# EAGLE design L1Demoscene (EAGLE 6.5.0)
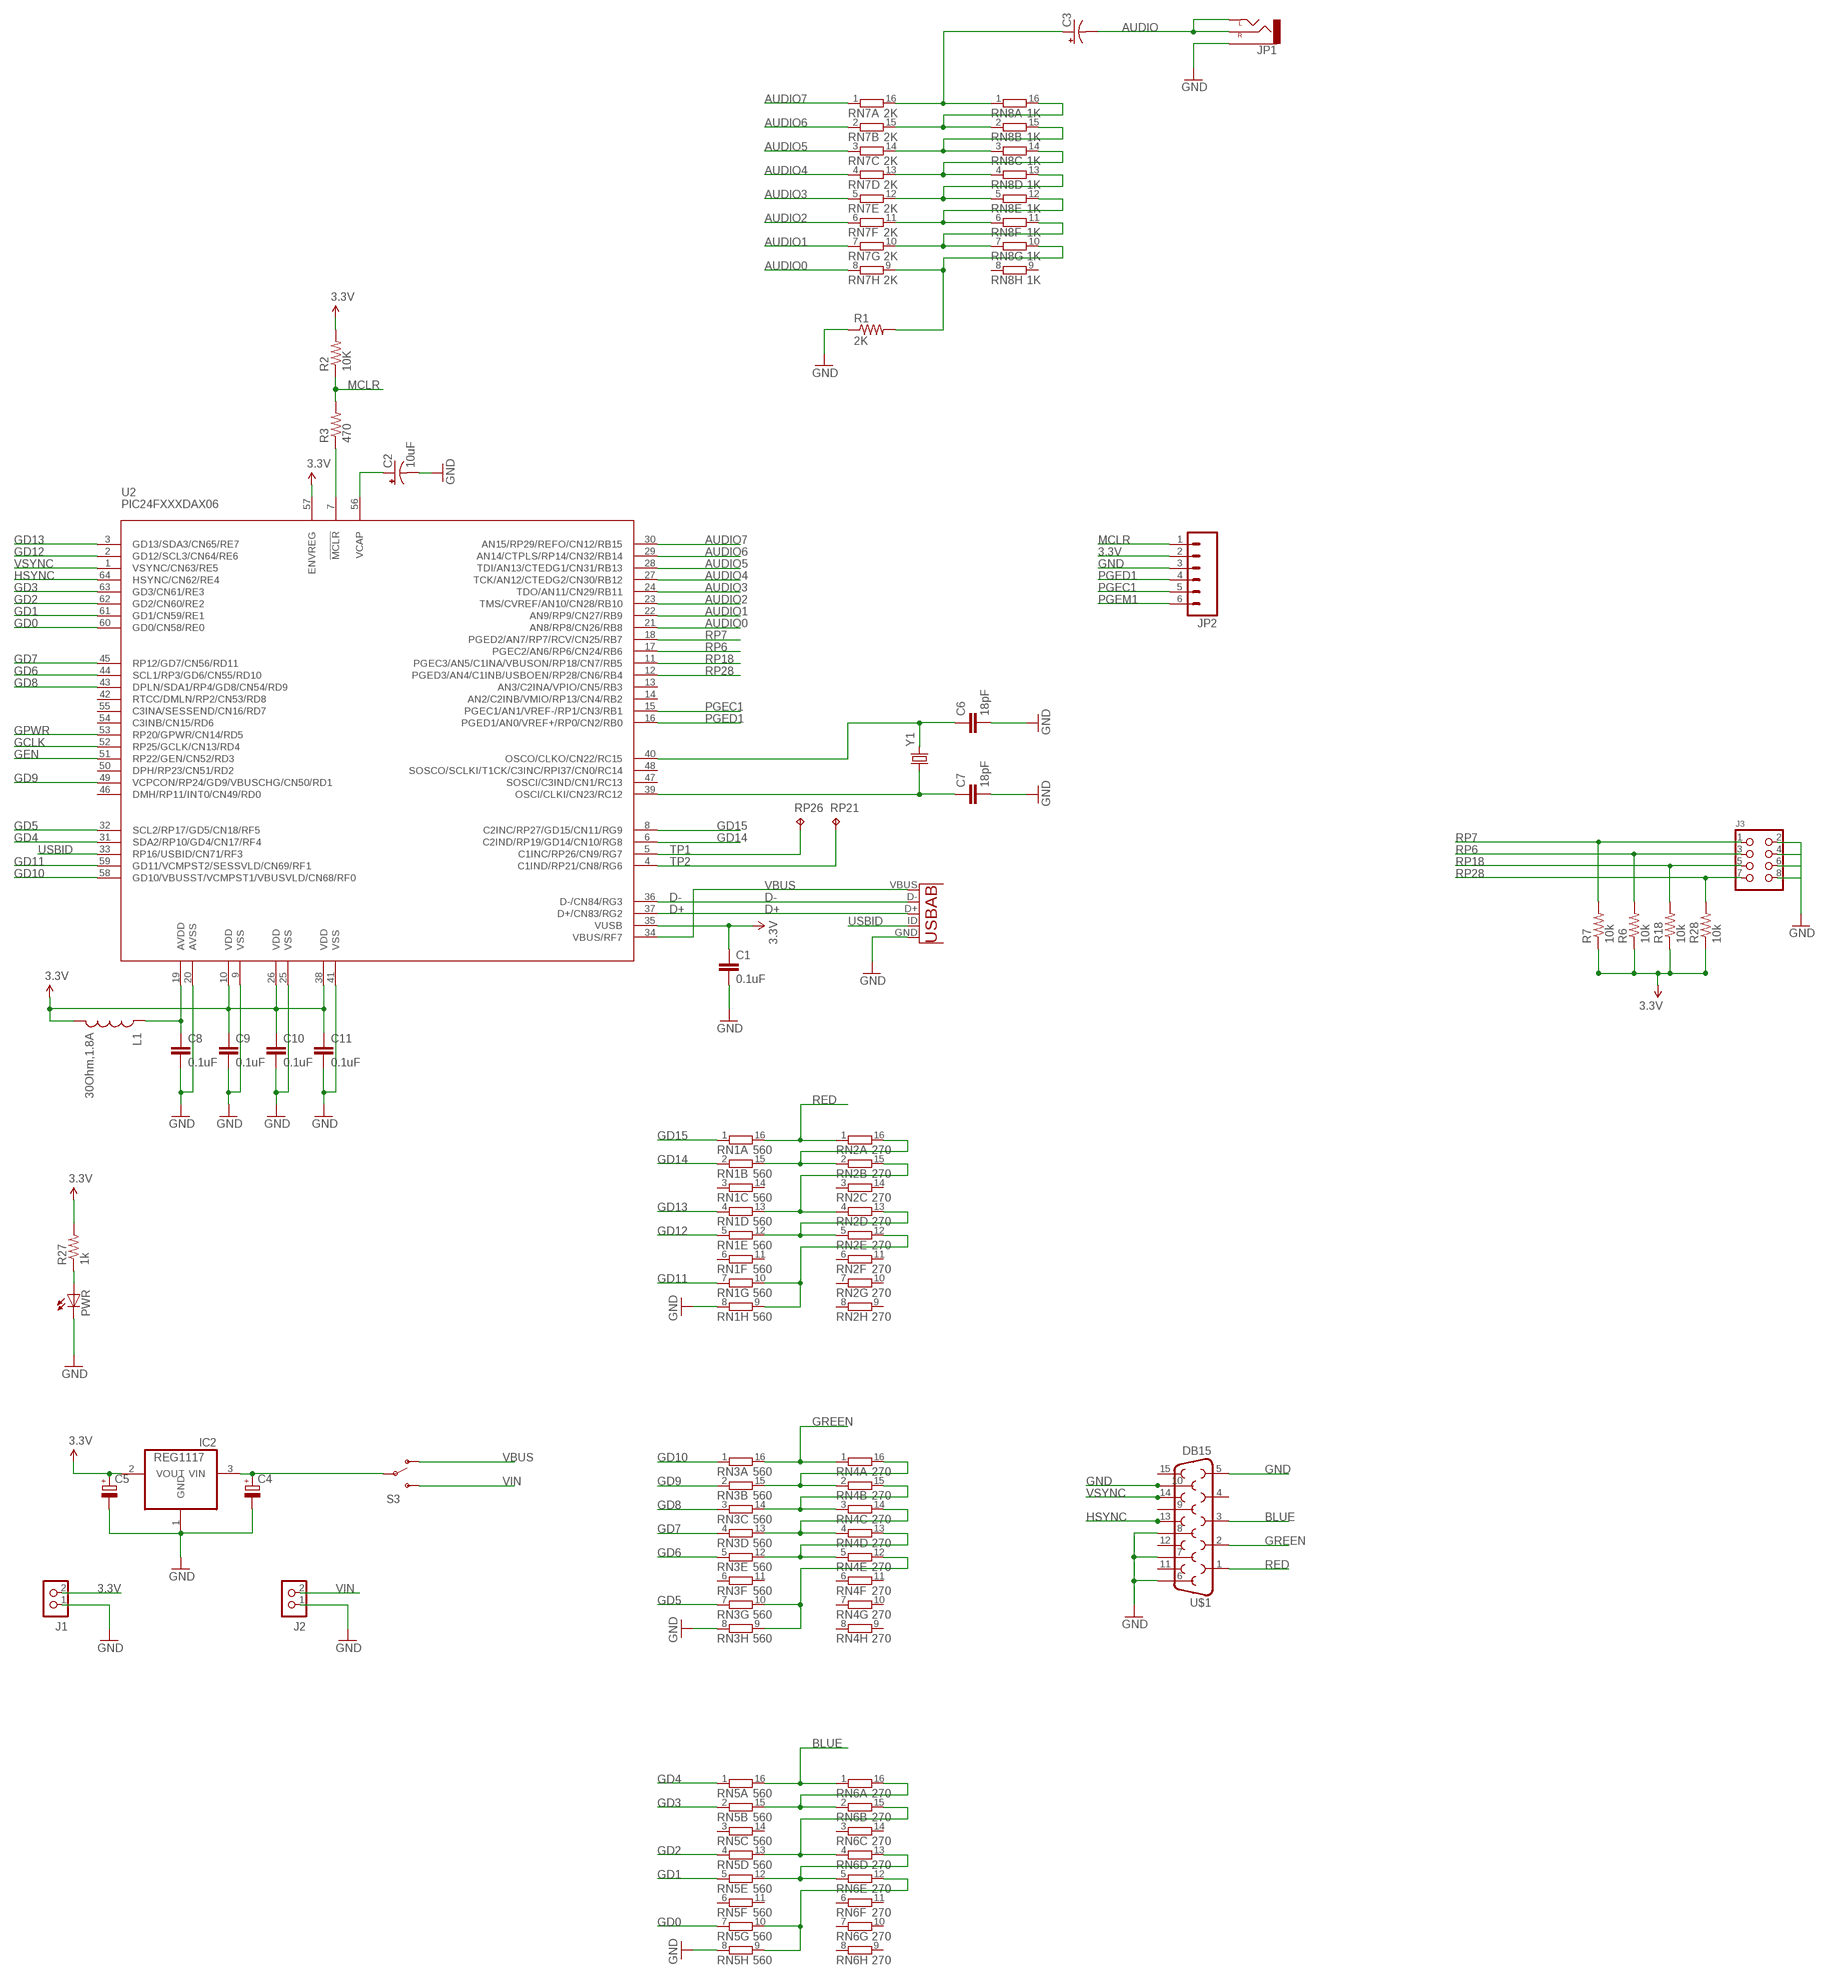
[diagram p0: schematic, sheet 1]

## Parts
C1  0.1uF  CAP0603-CAP  [0603-CAP]
C2  10uF  CAP_POL1206  [EIA3216]
C3  CAP_POL1206  [EIA3216]
C4  CAPACITOR_POL-SMC_A  [SMC_A]
C5  CAPACITOR_POL-SMC_A  [SMC_A]
C6  18pF  CAP0603-CAP  [0603-CAP]
C7  18pF  CAP0603-CAP  [0603-CAP]
C8  0.1uF  CAP0603-CAP  [0603-CAP]
C9  0.1uF  CAP0603-CAP  [0603-CAP]
C10  0.1uF  CAP0603-CAP  [0603-CAP]
C11  0.1uF  CAP0603-CAP  [0603-CAP]
IC2  REG1117  [SOT223]
J1  CON_HEADER_1X02-PTH  [M1X2]
J2  CON_HEADER_1X02-PTH  [M1X2]
J3  CON_HEADER_2X04-PTH  [M2X4]
JP1  AUDIO-JACKPTH  [AUDIO-JACK]
JP2  M06SIP  [1X06]
L1  30Ohm,1.8A  INDUCTOR0402  [C0402]
PWR  LED-0603  [LED-603]
R1  2K  RESISTOR0603-RES  [0603-RES]
R2  10K  RESISTOR0603-RES  [0603-RES]
R3  470  RESISTOR0603-RES  [0603-RES]
R6  10k  RESISTOR0603-RES  [0603-RES]
R7  10k  RESISTOR0603-RES  [0603-RES]
R18  10k  RESISTOR0603-RES  [0603-RES]
R27  1k  RESISTOR0603-RES  [0603-RES]
R28  10k  RESISTOR0603-RES  [0603-RES]
RN1  560  8R-NEXB2HV  [EXB2HV]
RN2  270  8R-NEXB2HV  [EXB2HV]
RN3  560  8R-NEXB2HV  [EXB2HV]
RN4  270  8R-NEXB2HV  [EXB2HV]
RN5  560  8R-NEXB2HV  [EXB2HV]
RN6  270  8R-NEXB2HV  [EXB2HV]
RN7  2K  8R-NEXB2HV  [EXB2HV]
RN8  1K  8R-NEXB2HV  [EXB2HV]
RP21  TPTP06R  [TP06R]
RP26  TPTP06R  [TP06R]
S3  SWITCH-SPDT-SMD-A  [SWITCH-SPST-SMD-A]
U2  PIC24FXXXDAX06  [PIC24FXXX_TQFP64]
U3  USB-AB  [USB-AB-MICRO-SMD]
U$1  DB15  [DB15]
Y1  CRYSTAL5X3  [CRYSTAL-SMD-5X3]

## Nets
3.3V: C1.1 C5.+ C9.1 C10.1 C11.1 IC2.2(VOUT) J1.2 JP2.2 L1.2 R2.2 R6.1 R7.1 R18.1 R27.2 R28.1 U2.10(VDD) U2.26(VDD) U2.35(VUSB) U2.38(VDD) U2.57(ENVREG)
AUDIO: C3.C(-) JP1.RING(RIGHT) JP1.TIP(LEFT)
AUDIO0: RN7.8 U2.21(AN8/RP8/CN26/RB8)
AUDIO1: RN7.7 U2.22(AN9/RP9/CN27/RB9)
AUDIO2: RN7.6 U2.23(TMS/CVREF/AN10/CN28/RB10)
AUDIO3: RN7.5 U2.24(TDO/AN11/CN29/RB11)
AUDIO4: RN7.4 U2.27(TCK/AN12/CTEDG2/CN30/RB12)
AUDIO5: RN7.3 U2.28(TDI/AN13/CTEDG1/CN31/RB13)
AUDIO6: RN7.2 U2.29(AN14/CTPLS/RP14/CN32/RB14)
AUDIO7: RN7.1 U2.30(AN15/RP29/REFO/CN12/RB15)
BLUE: RN5.16 RN6.1 U$1.3
D+: U2.37(D+/CN83/RG2) U3.D+
D-: U2.36(D-/CN84/RG3) U3.D-
GCLK: U2.52(RP25/GCLK/CN13/RD4)
GD0: RN5.7 U2.60(GD0/CN58/RE0)
GD1: RN5.5 U2.61(GD1/CN59/RE1)
GD2: RN5.4 U2.62(GD2/CN60/RE2)
GD3: RN5.2 U2.63(GD3/CN61/RE3)
GD4: RN5.1 U2.31(SDA2/RP10/GD4/CN17/RF4)
GD5: RN3.7 U2.32(SCL2/RP17/GD5/CN18/RF5)
GD6: RN3.5 U2.44(SCL1/RP3/GD6/CN55/RD10)
GD7: RN3.4 U2.45(RP12/GD7/CN56/RD11)
GD8: RN3.3 U2.43(DPLN/SDA1/RP4/GD8/CN54/RD9)
GD9: RN3.2 U2.49(VCPCON/RP24/GD9/VBUSCHG/CN50/RD1)
GD10: RN3.1 U2.58(GD10/VBUSST/VCMPST1/VBUSVLD/CN68/RF0)
GD11: RN1.7 U2.59(GD11/VCMPST2/SESSVLD/CN69/RF1)
GD12: RN1.5 U2.2(GD12/SCL3/CN64/RE6)
GD13: RN1.4 U2.3(GD13/SDA3/CN65/RE7)
GD14: RN1.2 U2.6(C2IND/RP19/GD14/CN10/RG8)
GD15: RN1.1 U2.8(C2INC/RP27/GD15/CN11/RG9)
GEN: U2.51(RP22/GEN/CN52/RD3)
GND: C1.2 C2.C(-) C4.- C5.- C6.2 C7.2 C8.2 C9.2 C10.2 C11.2 IC2.1(GND) J1.1 J2.1 J3.2 J3.4 J3.6 J3.8 JP1.SLEEVE JP2.3 PWR.C R1.1 RN1.8 RN3.8 RN5.8 U2.9(VSS) U2.20(AVSS) U2.25(VSS) U2.41(VSS) U3.GND U$1.5 U$1.6 U$1.7 U$1.8 U$1.10
GPWR: U2.53(RP20/GPWR/CN14/RD5)
GREEN: RN3.16 RN4.1 U$1.2
HSYNC: U2.64(HSYNC/CN62/RE4) U$1.13
MCLR: JP2.1 R2.1 R3.2
N$1: C8.1 L1.1 U2.19(AVDD)
N$2: C3.A(+) RN7.16 RN8.1
N$3: C7.1 U2.39(OSCI/CLKI/CN23/RC12) Y1.1
N$4: R3.1 U2.7(!MCLR)
N$5: RN7.15 RN8.2 RN8.16
N$6: RN7.14 RN8.3 RN8.15
N$7: C4.+ IC2.3(VIN) S3.2(P)
N$8: C2.A(+) U2.56(VCAP)
N$9: RN7.13 RN8.4 RN8.14
N$10: PWR.A R27.1
N$11: RN7.12 RN8.5 RN8.13
N$12: RN7.11 RN8.6 RN8.12
N$13: RN7.10 RN8.7 RN8.11
N$14: RN3.15 RN4.2 RN4.16
N$15: RN3.14 RN4.3 RN4.15
N$16: RN3.13 RN4.4 RN4.14
N$17: RN3.12 RN4.5 RN4.13
N$18: RN3.9 RN3.10 RN4.12
N$19: R1.2 RN7.9 RN8.10
N$20: C6.1 U2.40(OSCO/CLKO/CN22/RC15) Y1.3
N$24: RN1.13 RN2.4 RN2.15
N$26: RN1.15 RN2.2 RN2.16
N$27: RN1.12 RN2.5 RN2.13
N$28: RN1.9 RN1.10 RN2.12
N$31: RN5.15 RN6.2 RN6.16
N$32: RN5.13 RN6.4 RN6.15
N$33: RN5.12 RN6.5 RN6.13
N$34: RN5.9 RN5.10 RN6.12
PGEC1: JP2.5 U2.15(PGEC1/AN1/VREF-/RP1/CN3/RB1)
PGED1: JP2.4 U2.16(PGED1/AN0/VREF+/RP0/CN2/RB0)
PGEM1: JP2.6
RED: RN1.16 RN2.1 U$1.1
RP6: J3.3 R6.2 U2.17(PGEC2/AN6/RP6/CN24/RB6)
RP7: J3.1 R7.2 U2.18(PGED2/AN7/RP7/RCV/CN25/RB7)
RP18: J3.5 R18.2 U2.11(PGEC3/AN5/C1INA/VBUSON/RP18/CN7/RB5)
RP28: J3.7 R28.2 U2.12(PGED3/AN4/C1INB/USBOEN/RP28/CN6/RB4)
TP1: RP26.TP U2.5(C1INC/RP26/CN9/RG7)
TP2: RP21.TP U2.4(C1IND/RP21/CN8/RG6)
USBID: U2.33(RP16/USBID/CN71/RF3) U3.ID(USBID)
VBUS: S3.1(O) U2.34(VBUS/RF7) U3.VBUS
VIN: J2.2 S3.3(S)
VSYNC: U2.1(VSYNC/CN63/RE5) U$1.14
Unconnected: RN1.3 RN1.6 RN1.11 RN1.14 RN2.3 RN2.6 RN2.7 RN2.8 RN2.9 RN2.10 RN2.11 RN2.14 RN3.6 RN3.11 RN4.6 RN4.7 RN4.8 RN4.9 RN4.10 RN4.11 RN5.3 RN5.6 RN5.11 RN5.14 RN6.3 RN6.6 RN6.7 RN6.8 RN6.9 RN6.10 RN6.11 RN6.14 RN8.8 RN8.9 U2.13(AN3/C2INA/VPIO/CN5/RB3) U2.14(AN2/C2INB/VMIO/RP13/CN4/RB2) U2.42(RTCC/DMLN/RP2/CN53/RD8) U2.46(DMH/RP11/INT0/CN49/RD0) U2.47(SOSCI/C3IND/CN1/RC13) U2.48(SOSCO/SCLKI/T1CK/C3INC/RPI37/CN0/RC14) U2.50(DPH/RP23/CN51/RD2) U2.54(C3INB/CN15/RD6) U2.55(C3INA/SESSEND/CN16/RD7) U$1.4 U$1.9 U$1.11 U$1.12 U$1.15

## Library data of the parts
C1 C6-C11 = SparkFun-Capacitors:CAP: Capacitor Standard 0603 ceramic capacitor, and 0.1" leaded capacitor.
C2 C3 = SparkFun-Capacitors:CAP_POL: Capacitor Polarized These are standard SMD and PTH capacitors. Normally 10uF, 47uF, and 100uF in electrolytic and tantalum varieties. Always verify the external diameter of the through hole cap, it varies with capacity, voltage, and manufacturer. The EIA devices should be standard.
C4 C5 = dp_devices:CAPACITOR_POL: Polarized capacitor in various packages
IC2 = burr-brown:REG1117: 800mA and 1A Low Dropout (LDO) Positive Regulator 1.8V, 2.5V, 2.85V, 3.3V, 5V, and Adj; MPN: REG1117; OC_FARNELL: 1097566; OC_NEWARK: 14P6981
J1 J2 = dp_devices:CON_HEADER_1X02
J3 = dp_devices:CON_HEADER_2X04
JP1 = SparkFun-Connectors:AUDIO-JACK: 3.5mm Audio Jack Simple 3.5mm common PCB mount audio jack. SKU: PRT-08032
JP2 = SparkFun-Connectors:M06: Header 6 Standard 6-pin 0.1" header. Use with straight break away headers (SKU : PRT-00116), right angle break away headers (PRT-00553), swiss pins (PRT-00743), machine pins (PRT-00117), and female headers (PRT-00115). Molex polarized connector foot print use with SKU : PRT-08094 with associated crimp pins and housings. NOTES ON THE VARIANTS LOCK and LOCK_LONGPADS... This footprint was designed to help hold the alignment of a through-hole component (i.e. 6-pin header) while soldering it into place. You may notice that each hole has been shifted either up or down by 0.005 of an inch from it's more standard position (which is a perfectly straight line). This slight alteration caused the pins (the squares in the middle) to touch the edges of the holes. Because they are alternating, it causes a "brace" to hold the component in place. 0.005 has proven to be the perfect amount of "off-center" position when using our standard breakaway headers. Although looks a little odd when you look at the bare footprint, once you have a header in there, the alteration is very hard to notice. Also,if you push a header all the way into place, it is covered up entirely on the bottom side. This idea of altering the position of holes to aid alignment will be further integrated into the Sparkfun Library for other footprints. It can help hold any component with 3 or more connection pins.
L1 = SparkFun-Passives:INDUCTOR: Inductors Basic Inductor/Choke - 0603 and 1206. Footprints are not proven and vary greatly between part numbers. SRN6045- 33uH, 20% 1.4A SDR0403-560KL - 56uH, 10%, 500mA RMS/740mA peak
PWR = dp_devices:LED: Light Emitting Diode
R1-R3 R6 R7 R18 R27 R28 = SparkFun-Resistors:RESISTOR: Resistor Basic schematic elements and footprints for 0603, 1206, and PTH resistors.
RN1-RN8 = resistor-dil:8R-N: DIL RESISTOR; OC_FARNELL: unknown; OC_NEWARK: unknown
RP21 RP26 = testpad:TP: Test pad
S3 = SparkFun-Electromechanical:SWITCH-SPDT: SPDT Switch Simple slide switch, Spark Fun Electronics SKU : COM-00102 DPDT SMT slide switch, AYZ0202, SWCH-08179
U2 = SparkFun-DigitalIC:PIC24FXXXDAX06: PIC24FXXXDAX06 PIC24FXXXDA106 / PIC24FXXXDA206 PIC24FJ256DA206-I/PT for IOIO IC-10386; PROD_ID: IC-10386
U3 = SparkFun-Connectors:USB-AB: This is a USB AB connector that is compatible with USB OTG. i.e. this connector can serve as a host or device
U$1 = SparkFun-Connectors:DB15: DB15 / VGA right angle through-hole female connector.
Y1 = SparkFun-FreqCtrl:CRYSTAL: Various standard crystals. Proven footprints. Spark Fun Electronics SKU : COM-00534

## Board
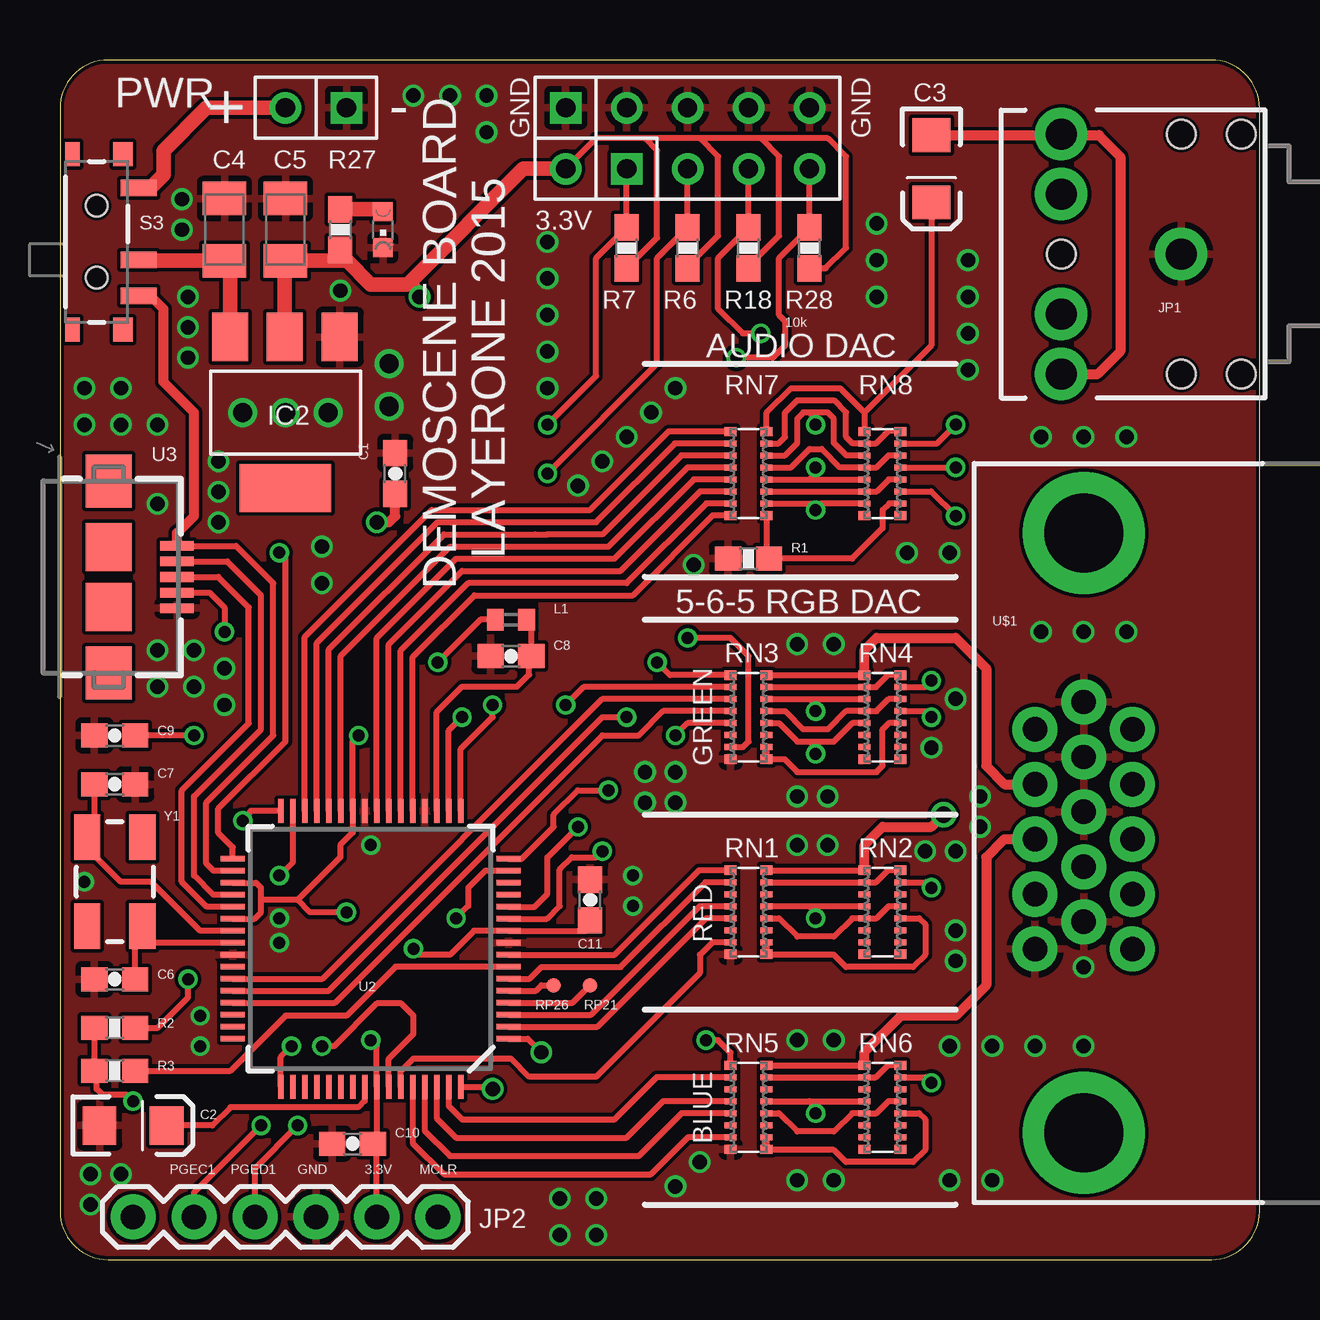
[diagram p1: board, top side]
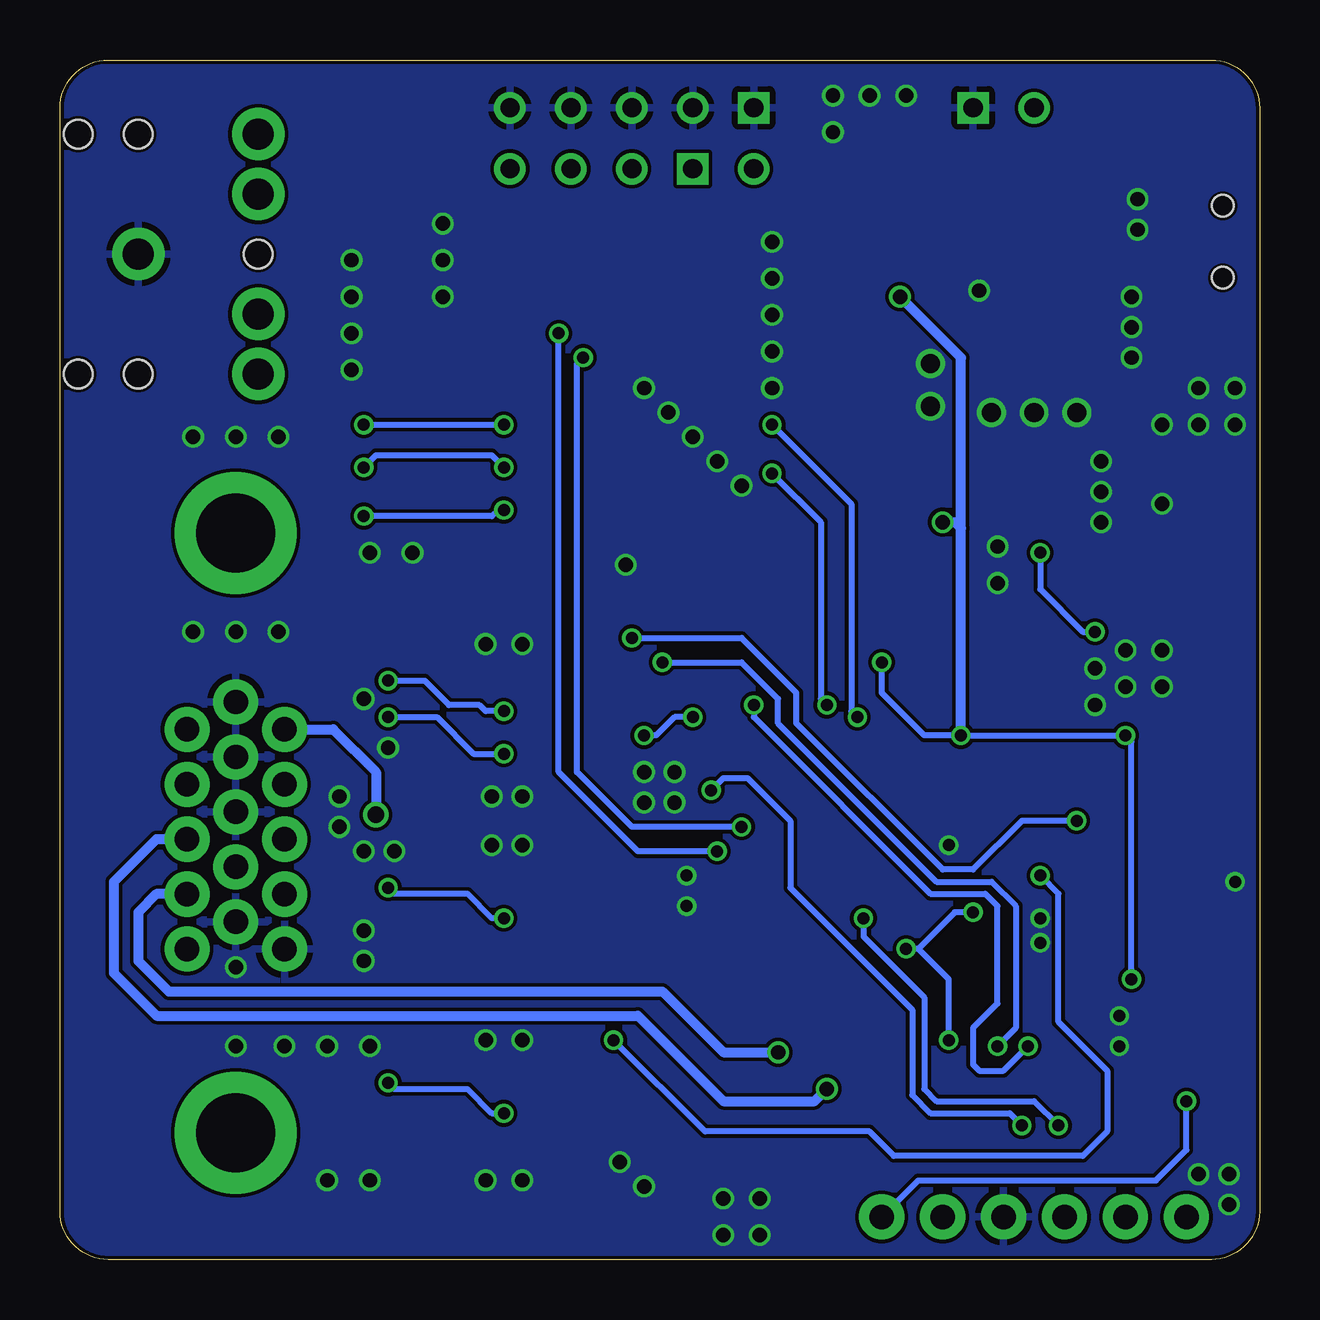
[diagram p2: board, bottom side, seen from below]

Size 50 x 50 mm. Coordinates in mm from the lower left corner, seen from the top.
Outline: 50,2 50,48 arc90 48,50 2,50 arc90 0,48 0,2 arc90 2,0 48,0 arc90 50,2
Copper layers (1*16): Top 0.035mm / dielectric 1.5mm / Bottom 0.035mm
Design rules "hackvana": minimum track width 6mil, minimum drill 0.3mm, track to track 6mil, track to pad 6mil, pad to pad 6mil, via to via 6mil, smd to smd 0mil, copper to edge 6mil, drill to drill 6mil, minimum pad ring 10mil, minimum via ring 6mil, stop-mask expansion 2mil, vias tented up to drill 100mil, thermal gap 10mil

### Footprints (pad centres in the part's own frame; a part is rotated, then mirrored left to right if it is on the bottom)
0603-CAP = smd 1.1 x 1: 1 -0.85,0; 2 0.85,0
EIA3216 = smd 1.4 x 1.6: A 1.4,0; C -1.4,0
SMC_A = smd 1.4 x 1.8: + -1.3,0; - 1.3,0
SOT223 = smd 1.499 x 2.007: 1 -2.261,-3.15; 2 0.025,-3.15; 3 2.311,-3.15 | smd 3.81 x 2.007: 4 0,3.15
M1X2 = drill 0.8 square: 1 -1.27,0 | drill 0.8: 2 1.27,0
M2X4 = drill 0.8 square: 1 -3.81,-1.27 | drill 0.8: 2 -3.81,1.27; 3 -1.27,-1.27; 4 -1.27,1.27; 5 1.27,-1.27; 6 1.27,1.27; 7 3.81,-1.27; 8 3.81,1.27
AUDIO-JACK = drill 1.3 pad 2.184: RING 5,5; RSH 5,2.5; SLEEVE 0,0; TIP 5,-5; TSH 5,-2.5 | hole 1.2: 0,5; -2.5,5; -2.5,-5; 0,-5; 5,0
1X06 = drill 1.016 pad 1.88: 1 0,0; 2 2.54,0; 3 5.08,0; 4 7.62,0; 5 10.16,0; 6 12.7,0
C0402 = smd 0.7 x 0.9: 1 -0.65,0; 2 0.65,0
LED-603 = smd 0.8 x 0.8: A 0,-0.75; C 0,0.75
0603-RES = smd 1.1 x 1: 1 -0.85,0; 2 0.85,0
EXB2HV = smd 0.38 x 0.5: 1 -1.75,-0.75; 8 1.75,-0.75; 9 1.75,0.75; 16 -1.75,0.75 | smd 0.25 x 0.5: 2 -1.25,-0.75; 3 -0.75,-0.75; 4 -0.25,-0.75; 5 0.25,-0.75; 6 0.75,-0.75; 7 1.25,-0.75; 10 1.25,0.75; 11 0.75,0.75; 12 0.25,0.75; 13 -0.25,0.75; 14 -0.75,0.75; 15 -1.25,0.75
TP06R = smd 0.6 x 0.6: TP 0,0
SWITCH-SPST-SMD-A = smd 0.7 x 1.5: 1 -2.25,-1.75; 2 -0.75,-1.75; 3 2.25,-1.75 | smd 1 x 0.6: GND1 -3.65,1; GND3 3.65,1 | smd 1 x 0.8: GND2 -3.65,-1.1; GND4 3.65,-1.1 | hole 0.9: -1.5,0; 1.5,0
PIC24FXXX_TQFP64 = smd 0.22 x 1: 1 -3.75,-5.75; 2 -3.25,-5.75; 3 -2.75,-5.75; 4 -2.25,-5.75; 5 -1.75,-5.75; 6 -1.25,-5.75; 7 -0.75,-5.75; 8 -0.25,-5.75; 9 0.25,-5.75; 10 0.75,-5.75; 11 1.25,-5.75; 12 1.75,-5.75; 13 2.25,-5.75; 14 2.75,-5.75; 15 3.25,-5.75; 16 3.75,-5.75; 33 3.75,5.75; 34 3.25,5.75; 35 2.75,5.75; 36 2.25,5.75; 37 1.75,5.75; 38 1.25,5.75; 39 0.75,5.75; 40 0.25,5.75; 41 -0.25,5.75; 42 -0.75,5.75; 43 -1.25,5.75; 44 -1.75,5.75; 45 -2.25,5.75; 46 -2.75,5.75; 47 -3.25,5.75; 48 -3.75,5.75 | smd 1 x 0.22: 17 5.75,-3.75; 18 5.75,-3.25; 19 5.75,-2.75; 20 5.75,-2.25; 21 5.75,-1.75; 22 5.75,-1.25; 23 5.75,-0.75; 24 5.75,-0.25; 25 5.75,0.25; 26 5.75,0.75; 27 5.75,1.25; 28 5.75,1.75; 29 5.75,2.25; 30 5.75,2.75; 31 5.75,3.25; 32 5.75,3.75; 49 -5.75,3.75; 50 -5.75,3.25; 51 -5.75,2.75; 52 -5.75,2.25; 53 -5.75,1.75; 54 -5.75,1.25; 55 -5.75,0.75; 56 -5.75,0.25; 57 -5.75,-0.25; 58 -5.75,-0.75; 59 -5.75,-1.25; 60 -5.75,-1.75; 61 -5.75,-2.25; 62 -5.75,-2.75; 63 -5.75,-3.25; 64 -5.75,-3.75
USB-AB-MICRO-SMD = smd 1.4 x 0.4: D+ 2.85,0; D- 2.85,0.65; GND 2.85,-1.3; ID 2.85,-0.65; VBUS 2.85,1.3 | smd 1.9 x 2: P$6 0,1.25; P$7 0,-1.25 | smd 1.9 x 2.2: P$8 0,4; P$9 0,-4
DB15 = drill 1.016 pad 1.88: 1 -4.32,-7.112; 2 -2.03,-7.112; 3 0.26,-7.112; 4 2.55,-7.112; 5 4.84,-7.112; 6 -5.46,-5.08; 7 -3.17,-5.08; 8 -0.88,-5.08; 9 1.41,-5.08; 10 3.7,-5.08; 11 -4.32,-3.048; 12 -2.03,-3.048; 13 0.26,-3.048; 14 2.55,-3.048; 15 4.84,-3.048 | drill 3.302 pad 5.08: G1 -12.5,-5.08; G2 12.5,-5.08
CRYSTAL-SMD-5X3 = smd 1.9 x 1.1: 1 -1.85,-1.15; 2 1.85,-1.15; 3 1.85,1.15; 4 -1.85,1.15

### Placement (x,y rotation side)
C1  13.97,32.77 90 top
C2  3.05,5.59 0 top
C3  36.32,45.47 270 top
C4  6.86,42.93 90 top
C5  9.4,42.93 90 top
C6  2.29,11.68 180 top
C7  2.29,19.81 0 top
C8  18.8,25.15 180 top
C9  2.29,21.84 180 top
C10  12.19,4.83 180 top
C11  22.1,14.99 90 top
IC2  9.4,35.31 180 top
J1  21.08,46.74 270 top
J2  10.67,48.01 180 top
J3  27.43,46.74 0 top
JP1  46.74,41.91 180 top
JP2  15.75,1.78 180 top
L1  18.8,26.67 180 top
PWR  13.46,42.93 180 top
R1  28.7,29.21 0 top
R2  2.29,9.65 0 top
R3  2.29,7.87 180 top
R6  26.16,42.16 90 top
R7  23.62,42.16 90 top
R18  28.7,42.16 90 top
R27  11.68,42.93 270 top
R28  31.24,42.16 90 top
RN1  28.7,14.48 270 top
RN2  34.29,14.48 270 top
RN3  28.7,22.61 270 top
RN4  34.29,22.61 270 top
RN5  28.7,6.35 270 top
RN6  34.29,6.35 270 top
RN7  28.7,32.77 270 top
RN8  34.29,32.77 270 top
RP21  22.1,11.43 0 top
RP26  20.57,11.43 0 top
S3  1.52,42.42 90 top
U2  12.95,12.95 90 top
U3  2.03,28.45 0 top
U$1  47.75,17.78 270 top
Y1  2.29,15.75 270 top

### Tracks (layer width: path | path; a pad name or v marks a point on that pad's centre or on a via)
3.3V  (via drill 0.5, 0.6)
  Top 0.254: C11.1 21.92,13.7 U2.10 17.26,13.7 16.26,12.7 14.99,12.7 v14.73,12.95 | JP2.2 13.21,4.66 C10.1 13.2,4.99 U2.57 13.2,8.89 v12.95,9.14 | U2.35 8.17,15.7 8.38,15.49 8.38,14.99 | U2.38 8.11,14.2 8.38,14.48 8.38,14.99 | R7.1 24.89,42.58 24.89,46.23 24.38,46.74 | R6.1 26.16,41.4 27.43,42.67 27.43,45.97 26.67,46.74 | 24.38,46.74 22.35,46.74 J1.2 | 26.67,46.74 24.38,46.74 | R18.1 28.7,41.4 29.97,42.67 29.97,45.97 29.21,46.74 | 29.21,46.74 26.67,46.74 | R28.1 31.92,41.31 32.77,42.16 32.77,45.97 32,46.74 29.21,46.74 | 9.91,14.99 8.38,14.99 | v11.94,14.48 10.41,14.48 9.91,14.99 | v12.45,21.84 12.2,21.6 U2.26 12.2,17.79 11.68,17.27 11.68,16.76 9.91,14.99 | L1.2 17.53,26.67 v15.75,24.89 | v5.33,11.68 5.33,10.92 4.06,9.65 R2.2 | v5.59,21.84 C9.1
  Top 0.406: v14.99,40.13 14.99,40.39 14.61,40.77 | v13.21,30.73 13.72,30.73 13.97,30.99 C1.1
  Top 0.61: IC2.2 9.37,41.6 C5.+ 11.97,41.63 | 11.97,41.63 12.95,40.64 14.48,40.64 14.61,40.77 19.3,45.47 J1.2 | R27.2 11.68,41.91 11.97,41.63
  Bottom 0.254: v12.95,9.14 12.95,11.68 14.22,12.95 | 14.22,12.95 v14.73,12.95 | v11.94,14.48 12.7,14.48 14.22,12.95 | v5.33,11.68 5.33,21.59 v5.59,21.84 v12.45,21.84 13.97,21.84 15.75,23.62 v15.75,24.89
  Bottom 0.406: v12.45,21.84 12.45,30.48 | 12.45,30.48 12.45,37.59 v14.99,40.13 | v13.21,30.73 12.7,30.73 12.45,30.48
AUDIO
  Top 0.406: C3.C 41.69,46.87 | 41.69,46.87 JP1.TIP | 41.69,46.87 43.3,46.87 44.2,45.97 44.2,37.85 43.26,36.91 JP1.RING
AUDIO0
  Top 0.254: U2.21 14.7,25.12 17.27,27.69 23.88,27.69 27.21,31.02 RN7.8
AUDIO1
  Top 0.254: U2.22 14.2,25.38 17.02,28.19 23.62,28.19 26.94,31.52 RN7.7
AUDIO2
  Top 0.254: U2.23 13.7,25.64 16.76,28.7 23.37,28.7 26.68,32.02 RN7.6
AUDIO3
  Top 0.254: U2.24 13.2,25.9 16.51,29.21 23.11,29.21 26.42,32.52 RN7.5
AUDIO4
  Top 0.254: U2.27 11.7,25.17 16.26,29.72 22.86,29.72 26.16,33.02 RN7.4
AUDIO5
  Top 0.254: U2.28 11.2,25.43 16,30.23 19.81,30.23 20.32,30.23 22.61,30.23 25.9,33.52 RN7.3
AUDIO6
  Top 0.254: U2.29 10.7,25.69 15.75,30.73 22.35,30.73 25.63,34.02 RN7.2
AUDIO7
  Top 0.254: U2.30 10.2,25.95 15.49,31.24 22.1,31.24 25.37,34.52 RN7.1
BLUE
  Top 0.254: RN5.16 RN6.1
  Top 0.406: RN6.1 33.54,8.65 35.05,10.16 37.34,10.16 38.61,11.43 38.61,16.76 39.37,17.53 U$1.3
D+
  Top 0.254: U2.37 6.12,14.7 5.08,15.75 5.08,19.56 7.87,22.35 7.87,27.18 6.6,28.45 U3.D+
D-
  Top 0.254: U2.36 6.39,15.2 5.59,16 5.59,19.3 8.38,22.1 8.38,27.69 6.97,29.1 U3.D-
GD0
  Top 0.254: U2.60 14.7,4.85 16,3.56 24.64,3.56 26.18,5.1 RN5.7
GD1
  Top 0.254: U2.61 15.2,5.37 16.26,4.32 24.13,4.32 25.91,6.1 RN5.5
GD2
  Top 0.254: U2.62 15.7,5.89 16.51,5.08 23.62,5.08 25.14,6.6 RN5.4
GD3
  Top 0.254: U2.63 16.2,6.4 16.76,5.84 23.11,5.84 24.87,7.6 RN5.2
GD4  (via drill 0.5)
  Top 0.254: U2.31 9.7,16.56 v9.14,16 | RN5.1 27.95,8.62 27.43,9.14 v26.92,9.14
  Bottom 0.254: v26.92,9.14 23.11,5.33 16.26,5.33 15.24,4.32 7.37,4.32 6.35,5.33 6.35,7.87 8.38,9.91 8.38,15.24 v9.14,16
GD5  (via drill 0.5)
  Top 0.254: RN3.7 28.47,21.36 28.7,21.59 28.7,25.15 27.94,25.91 v26.16,25.91 | U2.32 7.97,18.7 v7.62,18.29
  Bottom 0.254: v26.16,25.91 21.59,25.91 19.3,23.62 19.3,22.35 13.21,16.26 11.94,16.26 9.91,18.29 v7.62,18.29
GD6  (via drill 0.5)
  Top 0.254: U2.44 11.2,11.2 22.61,22.61 v23.62,22.61 | RN3.5 26.17,22.36 v25.65,21.84
  Bottom 0.254: v23.62,22.61 24.38,22.61 25.15,21.84 v25.65,21.84
GD7
  Top 0.254: U2.45 11.47,10.7 22.61,21.84 24.13,21.84 25.14,22.86 RN3.4
GD8
  Top 0.254: U2.43 10.94,11.7 22.59,23.36 RN3.3
GD9  (via drill 0.5)
  Top 0.254: RN3.2 21.82,23.86 v21.08,23.11 | U2.49 9.2,8.44 v9.65,8.89
  Bottom 0.254: v21.08,23.11 21.08,22.61 13.72,15.24 11.43,15.24 10.92,14.73 10.92,10.67 11.94,9.65 11.94,8.13 11.68,7.87 10.67,7.87 v9.65,8.89
GD10  (via drill 0.5)
  Top 0.254: RN3.1 25.43,24.36 v24.89,24.89 | U2.58 13.7,8.37 14.73,9.4 14.73,10.16 14.22,10.67 13.21,10.67 11.43,8.89 v10.92,8.89
  Bottom 0.254: v24.89,24.89 21.59,24.89 20.07,23.37 20.07,22.35 13.46,15.75 11.18,15.75 10.16,14.73 10.16,9.65 v10.92,8.89
GD11
  Top 0.254: U2.59 14.2,7.85 14.73,8.38 18.8,8.38 19.56,7.62 22.35,7.62 26.67,11.94 26.67,12.7 27.2,13.23 RN1.7
GD12
  Top 0.254: RN1.5 26.93,14.23 22.4,9.7 U2.2
GD13
  Top 0.254: RN1.4 26.67,14.73 22.14,10.2 U2.3
GD14
  Top 0.254: RN1.2 26.9,15.73 23.37,12.19 20.07,12.19 19.58,11.7 U2.6
GD15
  Top 0.254: U2.8 23.12,12.7 26.64,16.23 RN1.1
GND  (via drill 0.5, 0.6, 0.8)
  other vias: 23.88,16 23.88,14.73 9.14,14.22 9.14,13.21 5.84,10.16 5.84,8.89 1.02,15.75 12.95,17.27 4.06,31.5 4.06,25.4 25.65,3.05 26.67,4.06 30.73,17.27 32,17.27 26.42,28.96 25.65,20.32 24.38,20.32 6.86,24.64 6.86,23.11 7.62,35.31 9.4,35.31 11.18,35.31 13.72,37.34 13.72,35.56 1.02,34.8 2.54,34.8 4.06,34.8 2.54,36.32 1.02,36.32 5.59,25.4 5.59,23.88 4.06,23.88 10.92,28.19 10.92,29.72 6.6,30.73 6.6,32 6.6,33.27 5.33,37.59 5.33,38.86 5.33,40.13 11.68,40.39 21.59,32.26 22.61,33.27 23.62,34.29 24.64,35.31 25.65,36.32 5.08,44.2 5.08,42.93 30.73,3.3 32.26,3.3 37.08,3.3 38.86,3.3 38.86,8.89 37.08,8.89 42.67,12.19 32.26,9.14 30.73,9.14 24.38,19.05 25.65,19.05 30.73,19.3 32,19.3 42.67,8.89 34.04,40.13 34.04,41.66 20.32,37.85 30.73,25.65 32.26,25.65 42.67,26.16 44.45,26.16 34.04,43.18 35.31,29.46 37.08,29.46 40.89,34.29 42.67,34.29 44.45,34.29 40.89,26.16 37.85,37.08 37.85,38.61 37.85,40.13 37.85,41.66 36.07,17.02 37.34,17.02 38.35,18.03 38.35,19.3 37.34,13.72 37.34,12.45 40.64,8.89 37.34,23.37 36.32,21.34 20.32,36.32 20.32,39.37 20.32,40.89 20.32,42.42 17.78,48.51 17.78,46.99 16.26,48.51 14.73,48.51 1.27,2.29 1.27,3.56 2.54,3.56 20.83,2.54 22.35,2.54 20.83,1.02 22.35,1.02
  pour Bottom: 0,0 50,0 50,50 0,50
  pour Top: 0,0 50,0 50,50 0,50
GREEN
  Top 0.254: RN3.16 RN4.1
  Top 0.406: RN4.1 33.54,25.41 34.04,25.91 37.34,25.91 38.61,24.64 38.61,20.57 39.37,19.81 U$1.2
HSYNC  (via drill 0.6)
  Top 0.254: U2.64 17.94,7.2 v18.03,7.11
  Bottom 0.406: v18.03,7.11 18.54,6.6 22.35,6.6 25.91,10.16 45.97,10.16 47.75,11.94 47.75,15.75 45.98,17.52 U$1.13
MCLR  (via drill 0.5)
  Top 0.254: R2.1 R3.2 1.52,7.79 1.52,7.11 1.78,6.86 2.79,6.86 v3.05,6.6
  Bottom 0.254: JP2.1 14.22,3.3 4.32,3.3 3.05,4.57 v3.05,6.6
N$1
  Top 0.254: L1.1 19.65,26.47 C8.1 19.56,25.06 19.56,24.38 19.05,23.88 16.76,23.88 15.7,22.82 U2.19
N$2
  Top 0.254: RN7.16 29.45,35.29 30.48,36.32 32.51,36.32 33.53,35.31 | 33.53,35.31 33.53,34.53 RN8.1 | C3.A 36.32,38.1 33.53,35.31
N$3
  Top 0.254: U2.39 5.85,13.7 3.81,15.75 2.54,15.75 1.27,17.02 1.27,17.46 Y1.1 1.44,17.9 C7.1
N$4
  Top 0.254: U2.7 13.98,12.2 11.94,10.16 9.4,10.16 7.11,7.87 R3.1
N$5
  Top 0.254: RN8.16 35.01,34.54 34.54,34.54 34.02,34.02 RN8.2 33.04,34.02 32.77,34.29 32.77,35.31 32.26,35.81 30.73,35.81 30.23,35.31 30.23,34.29 29.95,34.02 RN7.15
N$6  (via drill 0.5)
  Top 0.254: RN7.14 30.21,33.52 30.73,34.04 30.73,35.05 30.99,35.31 31.24,35.31 | RN8.3 32.78,33.52 32.26,34.04 32.26,35.05 32,35.31 31.24,35.31 | v31.5,34.8 31.5,35.05 31.24,35.31 | RN8.15 36.56,34.02 v37.34,34.8
  Bottom 0.254: v37.34,34.8 v31.5,34.8
N$7
  Top 0.61: IC2.3 7.09,41.4 C4.+ 3.32,41.63 S3.2
N$8
  Top 0.254: U2.56 12.7,6.61 12.45,6.35 7.11,6.35 6.35,5.59 C2.A
N$9
  Top 0.254: RN8.14 34.53,33.52 34.03,33.02 RN8.4 | RN8.4 | RN7.13 30.48,33.02 31.24,33.78 31.75,33.78 32.52,33.02 RN8.4
N$10
  Top 0.61: R27.1 13.36,43.78 PWR.A
N$11  (via drill 0.5)
  Top 0.254: RN7.12 31.24,32.52 | 31.24,32.52 RN8.5 | v31.5,33.02 31.5,32.77 31.24,32.52 | RN8.13 v37.33,33.02 v37.34,33.02
  Bottom 0.254: v37.34,33.02 36.83,33.53 32,33.53 v31.5,33.02
N$12
  Top 0.254: RN8.12 34.55,32.52 34.05,32.02 RN8.6 RN7.11
N$13  (via drill 0.5)
  Top 0.254: RN8.11 36.31,32.02 v37.34,30.99 | RN8.7 32,31.52 31.77,31.52 | 31.77,31.52 v31.5,31.24 | RN7.10 31.77,31.52
  Bottom 0.254: v31.5,31.24 31.75,31.24 32,30.99 v37.34,30.99
N$14
  Top 0.254: RN4.16 34.52,24.36 34.02,23.86 RN4.2 RN3.15
N$15  (via drill 0.5)
  Top 0.254: RN3.14 31.24,23.36 | 31.24,23.36 RN4.3 | RN4.15 36.05,23.86 v36.32,24.13 | v31.5,22.86 31.5,23.1 31.24,23.36
  Bottom 0.254: v36.32,24.13 34.8,24.13 33.78,23.11 32.51,23.11 32.26,22.86 v31.5,22.86
N$16
  Top 0.254: RN4.14 34.53,23.36 34.03,22.86 RN4.4 32.76,22.86 32,22.1 30.99,22.1 30.23,22.86 RN3.13
N$17  (via drill 0.5)
  Top 0.254: RN4.13 36.07,22.86 v36.32,22.61 | RN3.12 29.97,22.36 30.73,21.59 31.24,21.59 | RN4.5 33.02,22.36 32.26,21.59 31.24,21.59 | v31.5,21.08 31.5,21.34 31.24,21.59
  Bottom 0.254: v36.32,22.61 34.29,22.61 32.77,21.08 v31.5,21.08
N$18
  Top 0.254: RN3.10 RN3.9 30.2,20.86 30.73,20.32 34.04,20.32 34.29,20.57 34.29,22.1 34.55,22.36 RN4.12
N$19
  Top 0.254: RN8.10 34.56,31.52 34.29,31.24 34.29,30.48 33.02,29.21 R1.2 29.45,29.31 RN7.9
N$20
  Top 0.254: U2.40 3.56,13.2 3.56,13.21 3.56,13.78 Y1.3 3.14,13.6 C6.1
N$24  (via drill 0.5)
  Top 0.254: RN2.4 31.24,14.73 | 31.24,14.73 RN1.13 | RN2.15 36.09,15.73 v36.32,15.49 | v31.5,14.22 31.5,14.47 31.24,14.73
  Bottom 0.254: v31.5,14.22 32,14.22 33.02,15.24 36.07,15.24 v36.32,15.49
N$26
  Top 0.254: RN1.15 RN2.2 34.02,15.73 34.52,16.23 RN2.16
N$27
  Top 0.254: RN2.13 34.54,14.73 34.04,14.23 RN2.5 33.02,14.23 32.26,13.46 30.73,13.46 29.97,14.23 RN1.12
N$28
  Top 0.254: RN2.12 35.81,14.23 36.07,13.97 36.07,12.7 35.56,12.19 32.77,12.19 32.26,12.7 29.48,12.7 RN1.9 RN1.10
N$31
  Top 0.254: RN6.16 34.52,8.1 34.02,7.6 RN6.2 RN5.15
N$32  (via drill 0.5)
  Top 0.254: RN5.13 31.24,6.6 | 31.24,6.6 RN6.4 | RN6.15 36.09,7.6 v36.32,7.37 | v31.5,6.1 31.5,6.35 31.24,6.6
  Bottom 0.254: v36.32,7.37 36.07,7.11 33.02,7.11 32,6.1 v31.5,6.1
N$33
  Top 0.254: RN5.12 29.97,6.1 30.73,5.33 32.26,5.33 33.02,6.1 RN6.5 34.04,6.1 34.54,6.6 RN6.13
N$34
  Top 0.254: RN5.10 RN5.9 29.48,4.57 32.26,4.57 32.77,4.06 35.56,4.06 36.07,4.57 36.07,5.84 35.81,6.1 RN6.12
PGEC1  (via drill 0.5)
  Top 0.254: U2.15 17.73,16.2 17.02,15.49 17.02,14.73 v16.51,14.22 | JP2.5 5.59,2.79 v8.38,5.59
  Bottom 0.254: v16.51,14.22 16.51,13.46 13.97,10.92 13.97,7.11 13.46,6.6 9.4,6.6 v8.38,5.59
PGED1  (via drill 0.5)
  Top 0.254: U2.16 19.24,16.7 20.57,18.03 20.57,18.54 21.59,19.56 v22.86,19.56 | JP2.4 8.13,3.81 v9.91,5.59
  Bottom 0.254: v9.91,5.59 10.41,6.1 13.72,6.1 14.48,6.86 14.48,10.41 19.56,15.49 19.56,18.29 21.34,20.07 22.35,20.07 v22.86,19.56
RED  (via drill 0.7)
  Top 0.254: RN1.16 RN2.1
  Top 0.406: RN2.1 33.54,17.28 34.29,18.03 36.32,18.03 v36.83,18.54
  Bottom 0.406: U$1.1 38.61,22.1 36.83,20.32 v36.83,18.54
RP6  (via drill 0.5)
  Top 0.254: U2.17 16.7,21.28 18.03,22.61 v18.03,23.11 | J3.3 R6.2 24.89,41.74 24.89,37.34 v20.32,32.77
  Bottom 0.254: v20.32,32.77 18.29,30.73 18.29,23.37 v18.03,23.11
RP7  (via drill 0.5)
  Top 0.254: U2.18 16.2,22.05 v16.76,22.61 | J3.1 R7.2 22.35,41.74 22.35,36.83 v20.32,34.8
  Bottom 0.254: v20.32,34.8 17.02,31.5 17.02,22.86 v16.76,22.61
RP18  (via drill 0.5)
  Top 0.254: U2.11 20.3,14.2 20.83,14.73 20.83,16.26 21.34,16.76 22.35,16.76 v22.61,17.02 | J3.5 R18.2 27.43,41.74 27.43,39.62 28.45,38.61 v29.21,38.61
  Bottom 0.254: v22.61,17.02 25.91,17.02 29.21,20.32 v29.21,38.61
RP28  (via drill 0.5)
  Top 0.254: U2.12 19.78,14.7 20.32,15.24 20.32,16.76 v21.59,18.03 | J3.7 R28.2 29.97,41.74 29.97,39.37 30.23,39.12 30.23,38.1 29.72,37.59 v28.19,37.59
  Bottom 0.254: v21.59,18.03 26.16,18.03 28.45,20.32 28.45,37.34 v28.19,37.59
TP1
  Top 0.254: U2.5 19.84,11.2 20.07,11.43 RP26.TP
TP2
  Top 0.254: U2.4 21.37,10.7 RP21.TP
USBID  (via drill 0.5)
  Top 0.254: U2.33 7.2,17.18 6.6,17.78 6.6,18.8 9.4,21.59 9.4,29.21 v9.14,29.46 | U3.ID 6.24,27.8 6.86,27.18 v6.86,26.16
  Bottom 0.254: v9.14,29.46 9.14,27.94 7.37,26.16 v6.86,26.16
VBUS
  Top 0.254: U2.34 6.4,16.2 6.1,16.51 6.1,19.05 8.89,21.84 8.89,28.19 7.34,29.75 U3.VBUS
  Top 0.406: U3.VBUS 4.88,30.28 5.59,30.99 5.59,35.31 4.32,36.58 4.32,39.62 3.81,40.13 3.31,40.13 S3.1
VIN
  Top 0.61: J2.2 6.1,48.01 4.32,46.23 4.32,45.21 3.81,44.7 3.31,44.7 S3.3
VSYNC  (via drill 0.6)
  Top 0.254: U2.1 19.5,9.2 v20.07,8.64
  Bottom 0.406: v20.07,8.64 22.35,8.64 24.89,11.18 45.47,11.18 46.74,12.45 46.74,14.48 45.98,15.23 U$1.14

### Text on the board
tPlace: + | LAYERONE 2015 | DEMOSCENE BOARD
tNames: - | GND | GND | 3.3V | AUDIO DAC | 5-6-5 RGB DAC | GREEN | RED | BLUE | PGEC1 | PGED1 | GND | 3.3V | MCLR